# Altium project Traffic_Lignt_CU.PrjPCB
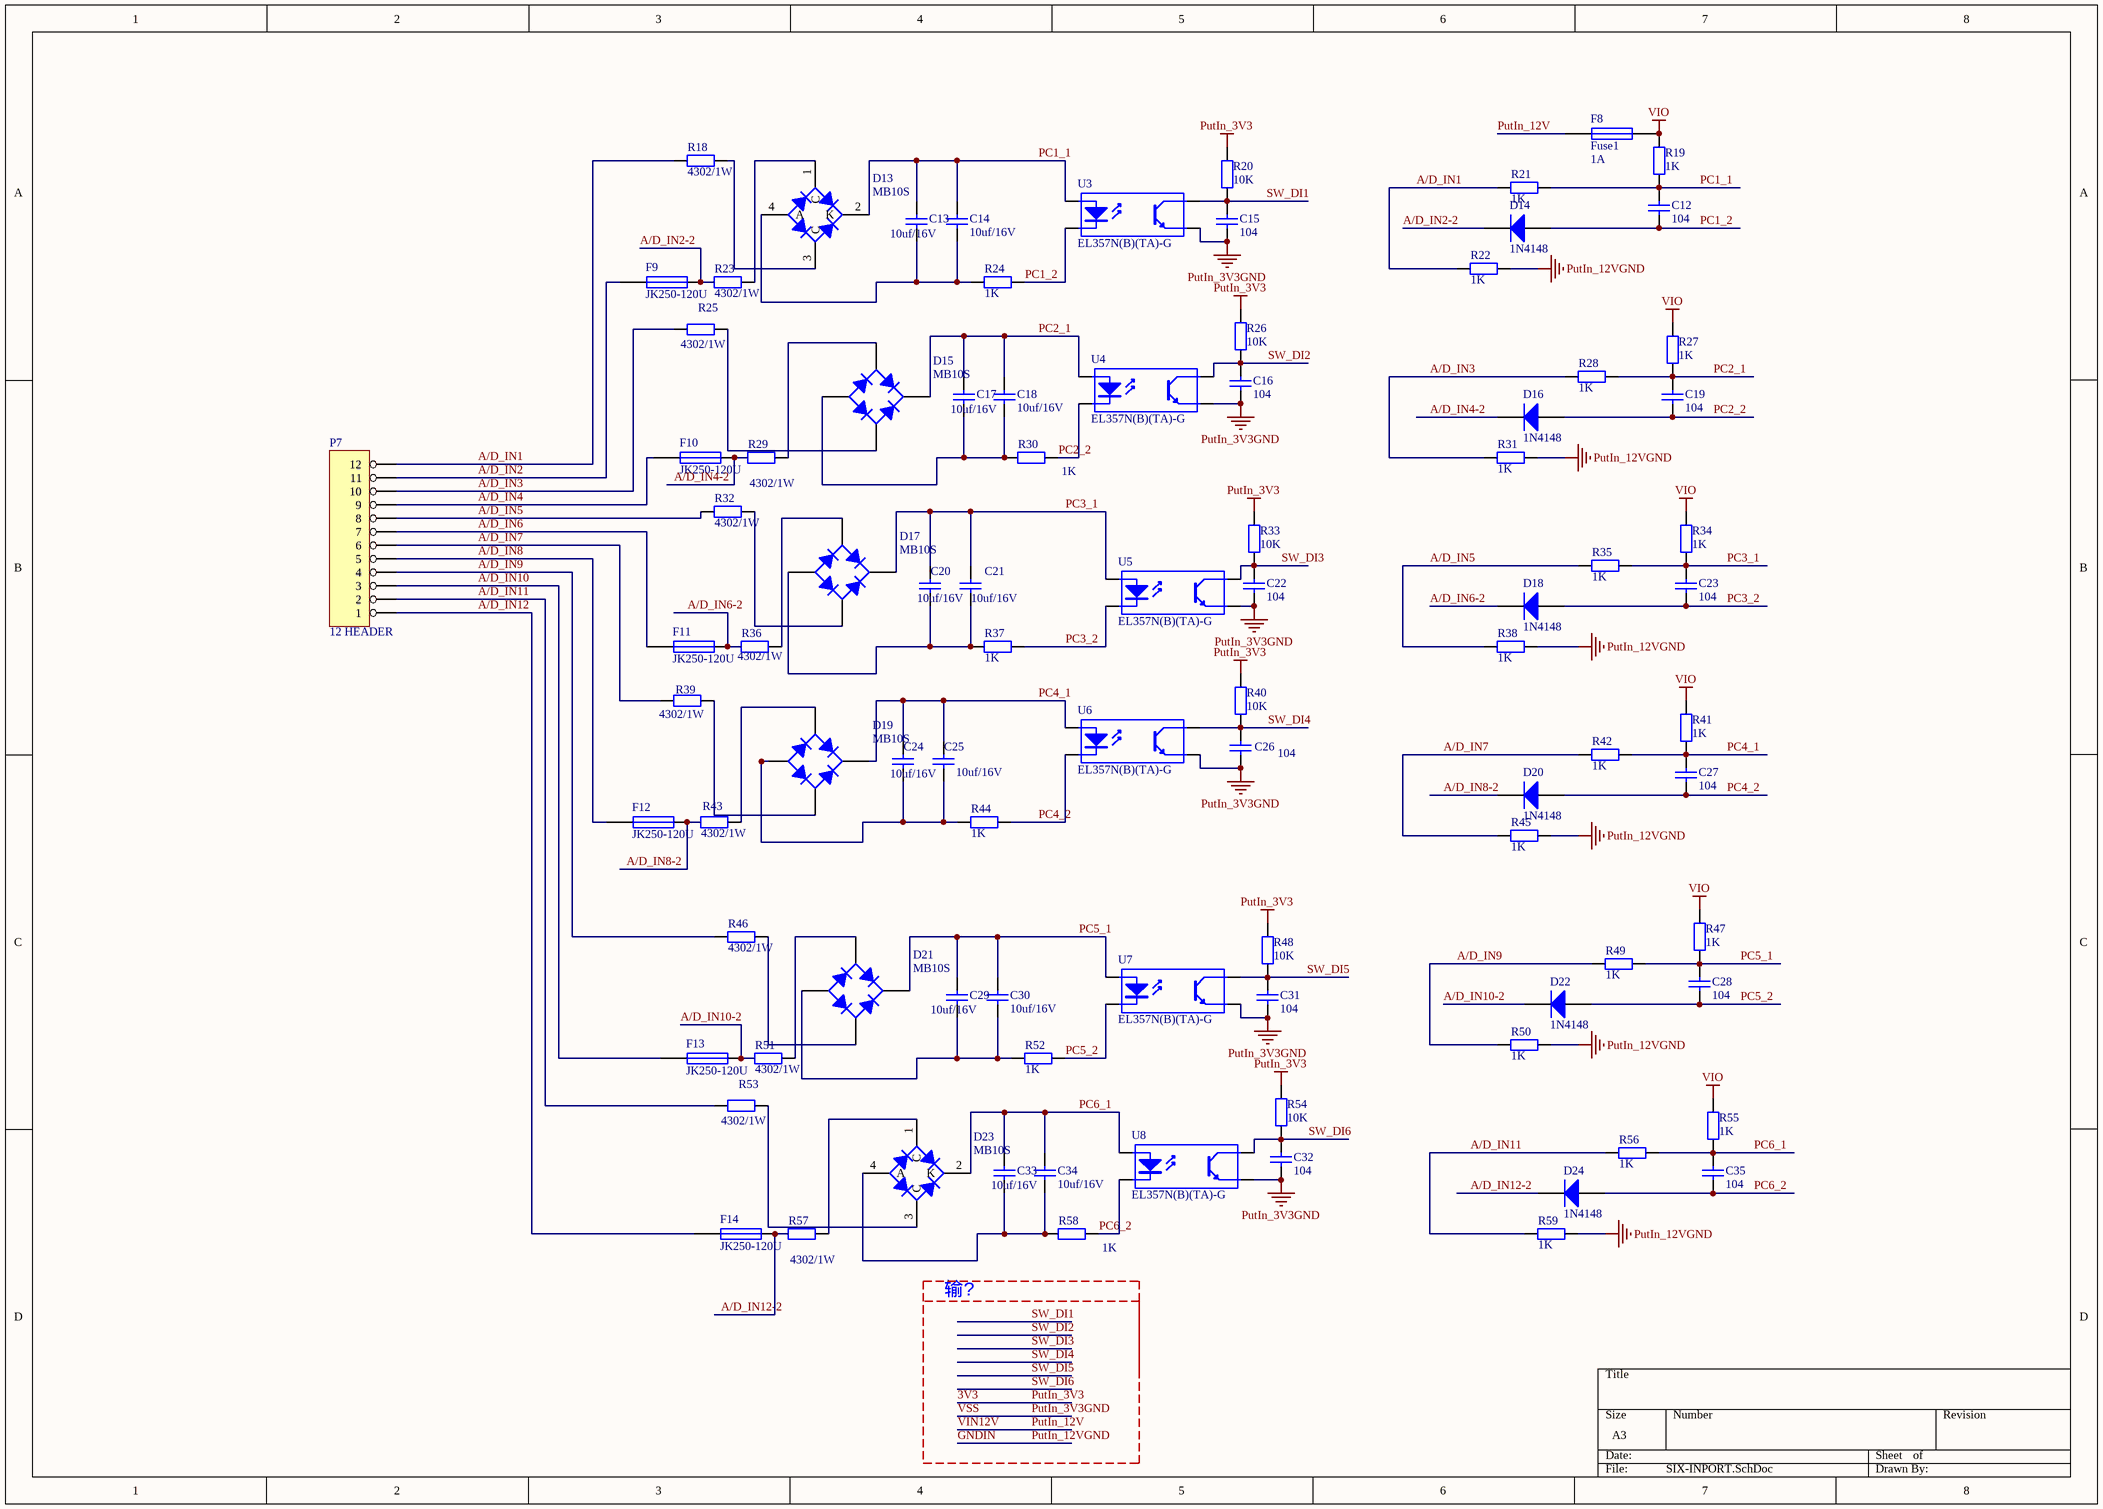
[diagram p0: SIX-INPORT.SchDoc]
5 sheets, 291 parts. Net scope: global (net labels, ports and power ports of the same name join across sheets).
Board file: Traffic_Lignt_CU.PcbDoc
Sheets:
  SIX-INPORT.SchDoc
  RS485.SchDoc
  SIX_OUTPORT-V2.SchDoc
  POWER.SchDoc
  STM32F103最小系统板.SchDoc

## Sheet SIX-INPORT.SchDoc
size A3

### Parts
(Parts that share a designator on the sheet are numbered #1, #2 ... from top to bottom, then left to right.)
C12  104  [LC-1206_C]
C13  10uf/16V  [LC-0805_C]
C14#1  10uf/16V  [LC-0805_C]
C15#1  104  [LC-0603_C]
C16  104  [LC-0603_C]
C17  10uf/16V  [LC-0805_C]
C18#1  10uf/16V  [LC-0805_C]
C19#1  104  [LC-1206_C]
C20  10uf/16V  [LC-0805_C]
C21  10uf/16V  [LC-0805_C]
C22  104  [LC-0603_C]
C23#1  104  [LC-1206_C]
C24  10uf/16V  [LC-0805_C]
C25  10uf/16V  [LC-0805_C]
C26  104  [LC-0603_C]
C27  104  [LC-1206_C]
C28  104  [LC-1206_C]
C29  10uf/16V  [LC-0805_C]
C30  10uf/16V  [LC-0805_C]
C31  104  [LC-0603_C]
C32  104  [LC-0603_C]
C33  10uf/16V  [LC-0805_C]
C34  10uf/16V  [LC-0805_C]
C35  104  [LC-1206_C]
D13  MB10S  [LC-MBS]
D14  1N4148  [LC-LL-34]
D15  MB10S  [LC-MBS]
D16#1  1N4148  [LC-LL-34]
D17  MB10S  [LC-MBS]
D18  1N4148  [LC-LL-34]
D19  MB10S  [LC-MBS]
D20  1N4148  [LC-LL-34]
D21  MB10S  [LC-MBS]
D22  1N4148  [LC-LL-34]
D23  MB10S  [LC-MBS]
D24  1N4148  [LC-LL-34]
F8  Fuse1  value 1A  [LC-1206_R]
F9  JK250-120U  [ntc250v]
F10  JK250-120U  [ntc250v]
F11  JK250-120U  [ntc250v]
F12  JK250-120U  [ntc250v]
F13  JK250-120U  [ntc250v]
F14  JK250-120U  [ntc250v]
P7  12 HEADER  [KF2EDG508-12]
R18#1  4302/1W  [LC-2512_R]
R19  value 1K  [LC-1206_R]  (hidden comment: Res1)
R20  10K  [LC-0603_R]
R21  value 1K  [LC-1206_R]  (hidden comment: Res1)
R22  value 1K  [LC-1206_R]  (hidden comment: Res1)
R23  4302/1W  [LC-2512_R]
R24  1K  [LC-0603_R]
R25  4302/1W  [LC-2512_R]
R26  10K  [LC-0603_R]
R27  value 1K  [LC-1206_R]  (hidden comment: Res1)
R28#1  value 1K  [LC-1206_R]  (hidden comment: Res1)
R29  4302/1W  [LC-2512_R]
R30  1K  [LC-0603_R]
R31  value 1K  [LC-1206_R]  (hidden comment: Res1)
R32  4302/1W  [LC-2512_R]
R33  10K  [LC-0603_R]
R34  value 1K  [LC-1206_R]  (hidden comment: Res1)
R35  value 1K  [LC-1206_R]  (hidden comment: Res1)
R36  4302/1W  [LC-2512_R]
R37  1K  [LC-0603_R]
R38  value 1K  [LC-1206_R]  (hidden comment: Res1)
R39  4302/1W  [LC-2512_R]
R40  10K  [LC-0603_R]
R41  value 1K  [LC-1206_R]  (hidden comment: Res1)
R42  value 1K  [LC-1206_R]  (hidden comment: Res1)
R43  4302/1W  [LC-2512_R]
R44  1K  [LC-0603_R]
R45  value 1K  [LC-1206_R]  (hidden comment: Res1)
R46  4302/1W  [LC-2512_R]
R47  value 1K  [LC-1206_R]  (hidden comment: Res1)
R48  10K  [LC-0603_R]
R49  value 1K  [LC-1206_R]  (hidden comment: Res1)
R50  value 1K  [LC-1206_R]  (hidden comment: Res1)
R51  4302/1W  [LC-2512_R]
R52  1K  [LC-0603_R]
R53  4302/1W  [LC-2512_R]
R54  10K  [LC-0603_R]
R55  value 1K  [LC-1206_R]  (hidden comment: Res1)
R56  value 1K  [LC-1206_R]  (hidden comment: Res1)
R57  4302/1W  [LC-2512_R]
R58  1K  [LC-0603_R]
R59  value 1K  [LC-1206_R]  (hidden comment: Res1)
U3  EL357N(B)(TA)-G  [LC-SOP-4_P2.54]
U4  EL357N(B)(TA)-G  [LC-SOP-4_P2.54]
U5  EL357N(B)(TA)-G  [LC-SOP-4_P2.54]
U6#1  EL357N(B)(TA)-G  [LC-SOP-4_P2.54]
U7  EL357N(B)(TA)-G  [LC-SOP-4_P2.54]
U8  EL357N(B)(TA)-G  [LC-SOP-4_P2.54]

### Nets
3V3: R20.2 R26.2 R33.2 R40.2 R48.2 R54.2  [also labelled PutIn_3V3]
GNDIN: R22.1 R31.1 R38.1 R45.1 R50.1 R59.1  [also labelled PutIn_12VGND]
PutIn_3V3GND: C15#1.2 C16.2 C22.2 C26.2 C31.2 C32.2 U3.3(E) U4.3(E) U5.3(E) U6#1.3(E) U7.3(E) U8.3(E)  [also labelled VSS]
PutIn_12V: F8.1  [also labelled VIN12V]
VIO: F8.2 R19.2 R27.1 R34.1 R41.1 R47.2 R55.1
A/D_IN1: P7.12 R18#1.1 R21.2 R22.2
A/D_IN2: F9.1 P7.11
A/D_IN2-2: D14.2(K) F9.2 R23.1
A/D_IN3: P7.10 R25.1 R28#1.2 R31.2
A/D_IN4: F10.1 P7.9
A/D_IN4-2: D16#1.2(K) F10.2 R29.1
A/D_IN5: P7.8 R32.1 R35.2 R38.2
A/D_IN6: F11.1 P7.7
A/D_IN6-2: D18.2(K) F11.2 R36.1
A/D_IN7: P7.6 R39.1 R42.2 R45.2
A/D_IN8: F12.1 P7.5
A/D_IN8-2: D20.2(K) F12.2 R43.1
A/D_IN9: P7.4 R46.1 R49.2 R50.2
A/D_IN10: F13.1 P7.3
A/D_IN10-2: D22.2(K) F13.2 R51.1
A/D_IN11: P7.2 R53.1 R56.2 R59.2
A/D_IN12: F14.1 P7.1
A/D_IN12-2: D24.2(K) F14.2 R57.1
PC1_1: C12.1 C13.2 C14#1.2 D13.2(K) R19.1 R21.1 U3.1(A)
PC1_2: C12.2 D14.1(A) R24.1 U3.2(K)
PC2_1: C17.2 C18#1.2 C19#1.1 D15.2(K) R27.2 R28#1.1 U4.1(A)
PC2_2: C19#1.2 D16#1.1(A) R30.1 U4.2(K)
PC3_1: C20.2 C21.2 C23#1.1 D17.2(K) R34.2 R35.1 U5.1(A)
PC3_2: C23#1.2 D18.1(A) R37.1 U5.2(K)
PC4_1: C24.2 C25.2 C27.1 D19.2(K) R41.2 R42.1 U6#1.1(A)
PC4_2: C27.2 D20.1(A) R44.1 U6#1.2(K)
PC5_1: C28.1 C29.2 C30.2 D21.2(K) R47.1 R49.1 U7.1(A)
PC5_2: C28.2 D22.1(A) R52.1 U7.2(K)
PC6_1: C33.2 C34.2 C35.1 D23.2(K) R55.2 R56.1 U8.1(A)
PC6_2: C35.2 D24.1(A) R58.1 U8.2(K)
SW_DI1: C15#1.1 R20.1 U3.4(C)
SW_DI2: C16.1 R26.1 U4.4(C)
SW_DI3: C22.1 R33.1 U5.4(C)
SW_DI4: C26.1 R40.1 U6#1.4(C)
SW_DI5: C31.1 R48.1 U7.4(C)
SW_DI6: C32.1 R54.1 U8.4(C)
NetC13_1: C13.1 C14#1.1 D13.4(A) R24.2
NetC17_1: C17.1 C18#1.1 D15.4(A) R30.2
NetC20_1: C20.1 C21.1 D17.4(A) R37.2
NetC24_1: C24.1 C25.1 D19.4(A) R44.2
NetC29_1: C29.1 C30.1 D21.4(A) R52.2
NetC33_1: C33.1 C34.1 D23.4(A) R58.2
NetD13_1: D13.1(C) R23.2
NetD13_3: D13.3(C) R18#1.2
NetD15_1: D15.1(C) R29.2
NetD15_3: D15.3(C) R25.2
NetD17_1: D17.1(C) R36.2
NetD17_3: D17.3(C) R32.2
NetD19_1: D19.1(C) R43.2
NetD19_3: D19.3(C) R39.2
NetD21_1: D21.1(C) R51.2
NetD21_3: D21.3(C) R46.2
NetD23_1: D23.1(C) R57.2
NetD23_3: D23.3(C) R53.2

### Notes on the sheet
- 输?

### Library data of the parts
C12 C19#1 C23#1 C27 C28 C35 = Cap: Capacitor; Value: 100nF; Published: 8-Jun-2000; Revision: July-2002: Re-released for DXP Platform.; Publisher: Altium Limited
C13 C14#1 C15#1 C16 C17 C18#1 C20-C22 C24-C26 C29-C34 = Cap: Capacitor; Value: 100pF; Published: 8-Jun-2000; LatestRevisionDate: 17-Jul-2002; LatestRevisionNote: Re-released for DXP Platform.; PackageReference: RAD-0.3; Publisher: Altium Limited; PackageDescription: Radial Cap, Thru-Hole; 2 Leads; 0.3 in Pin Spacing
D13 D15 D17 D19 D21 D23 = MBS M: 整流桥; ComponentLink1Description: 供应商链接; ComponentLink1URL: http://www.szlcsc.com/product/details_2865.html; Package: MBS; Supplier: LC; SuppliersPartNumber: C2488
D14 D16#1 D18 D20 D22 D24 = Diode: Default Diode; Published: 8-Jun-2000; LatestRevisionDate: 17-Jul-2002; LatestRevisionNote: Re-released for DXP Platform.; PackageDocument: Sep-1996; PackageReference: SMC; Publisher: Altium Limited; Code_JEDEC: DO-214-AB
F8 = Fus: 保险丝
F9-F14 = F: 保险丝; Value: 1A
P7 = 12 HEADER: 12 Pin Header
R18#1 R20 R23 R25 R26 R29 R32 R33 R36 R39 R40 R43 R46 R48 R51 R53 R54 R57 = Res2: Resistor; Value: 1K; Published: 8-Jun-2000; LatestRevisionDate: 17-Jul-2002; LatestRevisionNote: Re-released for DXP Platform.; PackageReference: AXIAL-0.4; Publisher: Altium Limited; PackageDescription: Axial Device, Thru-Hole; 2 Leads; 0.4 in Pin Spacing
R19 R21 R22 R27 R28#1 R31 R34 R35 R38 R41 R42 R45 R47 R49 R50 R55 R56 R59 = Res1: 贴片电阻; Published: 8-Jun-2000; LatestRevisionDate: 17-Jul-2002; LatestRevisionNote: Re-released for DXP Platform.; PackageReference: AXIAL-0.4; Publisher: Altium Limited
R24 R30 R37 R44 R52 R58 = Res2: Resistor; Published: 8-Jun-2000; LatestRevisionDate: 17-Jul-2002; LatestRevisionNote: Re-released for DXP Platform.; PackageReference: AXIAL-0.4; Publisher: Altium Limited; PackageDescription: Axial Device, Thru-Hole; 2 Leads; 0.4 in Pin Spacing; Value: 1K
U3-U5 U6#1 U7 U8 = EL357N(B): 贴片光耦; ComponentLink1Description: 供应商链接; ComponentLink1URL: http://www.szlcsc.com/product/details_7114.html; Package: SOP-4_P2.54; Supplier: LC; SuppliersPartNumber: C6649

## Sheet RS485.SchDoc
size A4
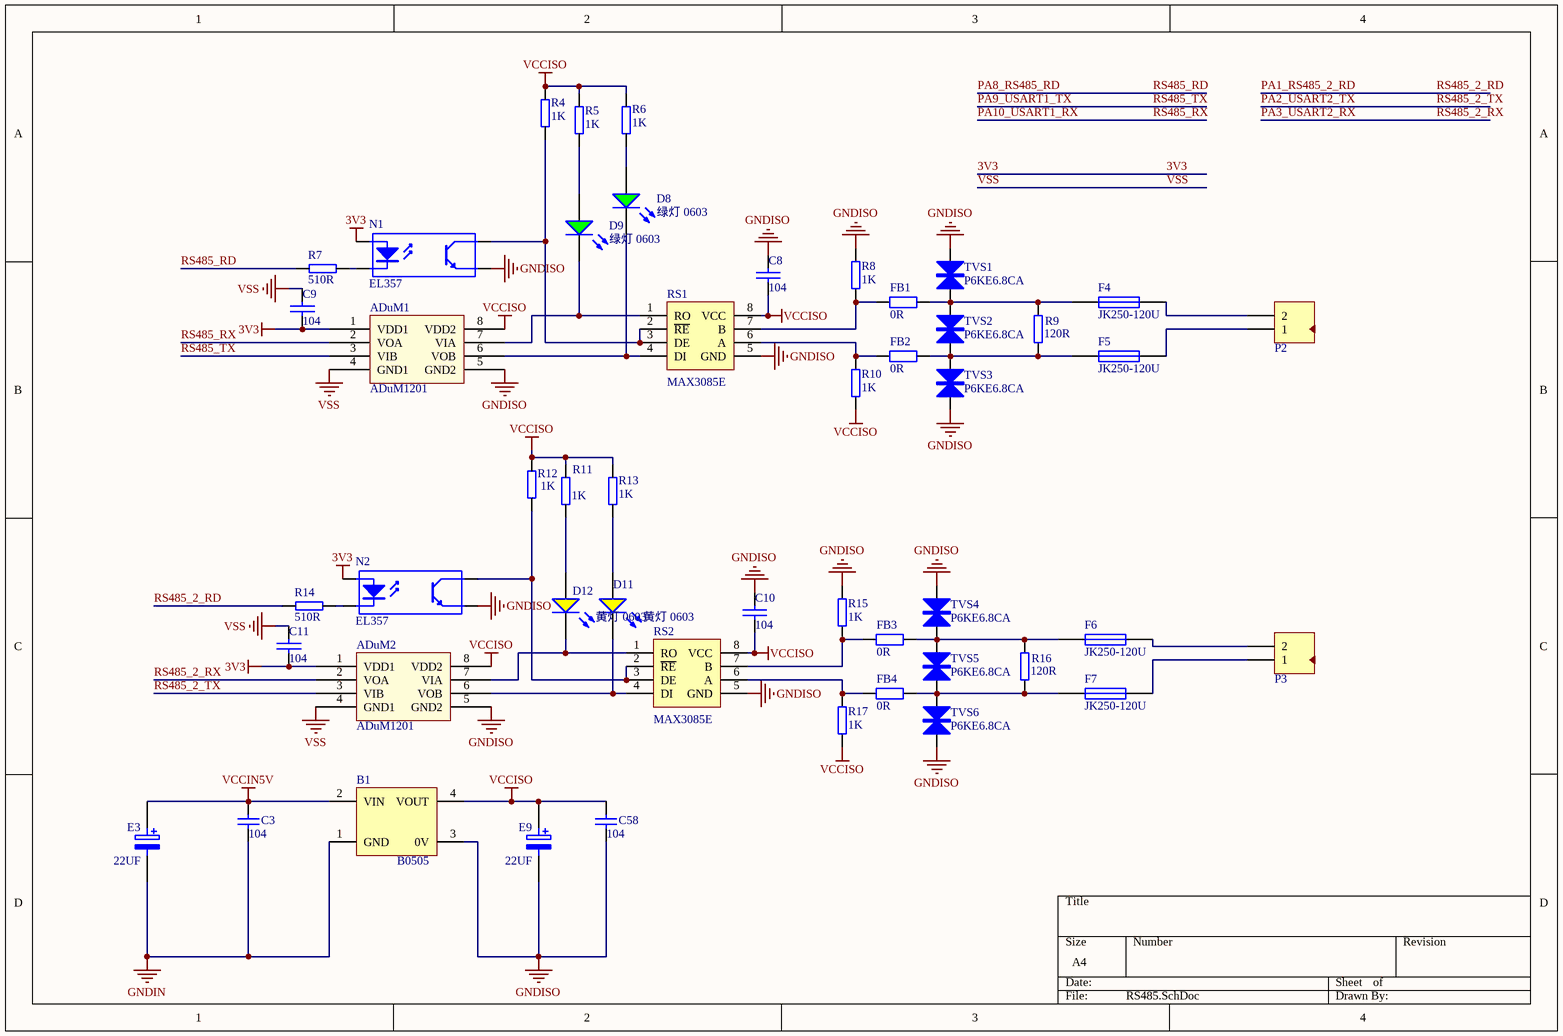
[diagram p1: RS485.SchDoc]

### Parts
(Parts that share a designator on the sheet are numbered #1, #2 ... from top to bottom, then left to right.)
ADuM1  ADuM1201  [SOIC-8]
ADuM2  ADuM1201  [SOIC-8]
B1  B0505  [B0505D-1WR2]
C3#1  104  [LC-0603_C]
C8  104  [LC-0603_C]
C9  104  [LC-0603_C]
C10  104  [LC-0603_C]
C11  104  [LC-0603_C]
C58  104  [LC-0603_C]
D8  绿灯 0603  [LC-0603_LED_S1]
D9  绿灯 0603  [LC-0603_LED_S1]
D11  黄灯 0603  [LC-0603_LED_S1]
D12  黄灯 0603  [LC-0603_LED_S1]
E3  22UF  [LC-CASE-B_3528]
E9  22UF  [LC-CASE-B_3528]
F4  JK250-120U  [ntc250v]
F5  JK250-120U  [ntc250v]
F6  JK250-120U  [ntc250v]
F7  JK250-120U  [ntc250v]
FB1  0R  [LC-0603_L]
FB2  0R  [LC-0603_L]
FB3  0R  [LC-0603_L]
FB4  0R  [LC-0603_L]
N1  EL357  [lc-sop-4_P2.54]
N2  EL357  [lc-sop-4_P2.54]
P2  Header 2  [D5.08-2P]  (value not drawn)
P3  Header 2  [D5.08-2P]  (value not drawn)
R4#1  1K  [LC-0603_R]
R5  1K  [LC-0603_R]
R6  1K  [LC-0603_R]
R7  510R  [LC-0603_R]
R8  1K  [LC-0603_R]
R9  120R  [LC-0603_R]
R10  1K  [LC-0603_R]
R11  1K  [LC-0603_R]
R12  1K  [LC-0603_R]
R13  1K  [LC-0603_R]
R14  510R  [LC-0603_R]
R15#1  1K  [LC-0603_R]
R16#1  120R  [LC-0603_R]
R17#1  1K  [LC-0603_R]
RS1  MAX3085E  [SOIC-8]
RS2  MAX3085E  [SOIC-8]
TVS1  P6KE6.8CA  [TVS]
TVS2  P6KE6.8CA  [TVS]
TVS3  P6KE6.8CA  [TVS]
TVS4  P6KE6.8CA  [TVS]
TVS5  P6KE6.8CA  [TVS]
TVS6  P6KE6.8CA  [TVS]

### Nets
3V3: ADuM1.1(VDD1) ADuM2.1(VDD1) C9.2 C11.2 N1.1(A) N2.1(A)
GNDIN: B1.1(GND) C3#1.2 E3.2
GNDISO: ADuM1.5(GND2) ADuM2.5(GND2) B1.3(0V) C8.1 C10.1 C58.2 E9.2 N1.3(E) N2.3(E) R8.1 R15#1.1 RS1.5(GND) RS2.5(GND) TVS1.2 TVS3.1 TVS4.2 TVS6.1
VCCIN5V: B1.2(VIN) C3#1.1 E3.1
VCCISO: ADuM1.8(VDD2) ADuM2.8(VDD2) B1.4(VOUT) C8.2 C10.2 C58.1 E9.1 R4#1.1 R5.2 R6.1 R10.2 R11.2 R12.1 R13.1 R17#1.2 RS1.8(VCC) RS2.8(VCC)
VSS: ADuM1.4(GND1) ADuM2.4(GND1) C9.1 C11.1  [project net PutIn_3V3GND]
PA1_RS485_2_RD: R14.1  [also labelled RS485_2_RD]
PA2_USART2_TX: ADuM2.3(VIB)  [also labelled RS485_2_TX]
PA3_USART2_RX: ADuM2.2(VOA)  [also labelled RS485_2_RX]
PA8_RS485_RD: R7.1  [also labelled RS485_RD]
PA9_USART1_TX: ADuM1.3(VIB)  [also labelled RS485_TX]
PA10_USART1_RX: ADuM1.2(VOA)  [also labelled RS485_RX]
NetADuM1_6: ADuM1.6(VOB) D8.K RS1.4(DI)
NetADuM1_7: ADuM1.7(VIA) D9.K RS1.1(RO)
NetADuM2_6: ADuM2.6(VOB) D11.K RS2.4(DI)
NetADuM2_7: ADuM2.7(VIA) D12.K RS2.1(RO)
NetD8_A: D8.A R6.2
NetD9_A: D9.A R5.1
NetD11_A: D11.A R13.2
NetD12_A: D12.A R11.1
NetF4_1: F4.1 FB1.1 R9.2 TVS1.1 TVS2.2
NetF4_2: F4.2 P2.2
NetF5_1: F5.1 FB2.1 R9.1 TVS2.1 TVS3.2
NetF5_2: F5.2 P2.1
NetF6_1: F6.1 FB3.1 R16#1.2 TVS4.1 TVS5.2
NetF6_2: F6.2 P3.2
NetF7_1: F7.1 FB4.1 R16#1.1 TVS5.1 TVS6.2
NetF7_2: F7.2 P3.1
NetFB1_2: FB1.2 R8.2 RS1.7(B)
NetFB2_2: FB2.2 R10.1 RS1.6(A)
NetFB3_2: FB3.2 R15#1.2 RS2.7(B)
NetFB4_2: FB4.2 R17#1.1 RS2.6(A)
NetN1_2: N1.2(K) R7.2
NetN1_4: N1.4(C) R4#1.2 RS1.2(~{RE}) RS1.3(DE)
NetN2_2: N2.2(K) R14.2
NetN2_4: N2.4(C) R12.2 RS2.2(~{RE}) RS2.3(DE)

### Library data of the parts
C3#1 C58 = Cap: Capacitor; Value: 100nF; Published: 8-Jun-2000; Revision: July-2002: Re-released for DXP Platform.; Publisher: Altium Limited
C8-C11 = CAP
D8 D9 D11 D12 = 0: 发光二极管; ComponentLink1Descrip: 供应商链接; Package: 0603; Supplier: LC
  D8 D9: ComponentLink1URL: http://www.szlcsc.com/product/details_73152.html; SuppliersPartNumber: C72043
  D11 D12: ComponentLink1URL: http://www.szlcsc.com/product/details_73147.html; SuppliersPartNumber: C72038
E3 E9 = ELECTRO2: Electrolytic Capacitor
F4-F7 = F: 保险丝; Value: 1A
FB1-FB4 = Res2: Resistor; Published: 8-Jun-2000; LatestRevisionDate: 17-Jul-2002; LatestRevisionNote: Re-released for DXP Platform.; PackageReference: AXIAL-0.4; Publisher: Altium Limited; Value: 0R
N1 N2 = ST188: 反射式光电传感器; Published: 24-Mar-1999; LatestRevisionDate: 04-Mar-2005; LatestRevisionNote: Sch pins 3 & 4 Swapped.; DatasheetDocument: Nov-2003; PackageReference: DIP-4; Publisher: Altium Limited
P2 P3 = He: 接插件; LatestRevisionDate: 17-Jul-2002; LatestRevisionNote: Re-released for DXP Platform.; Publisher: Altium Limited
R4#1 R5-R7 R11-R14 = RES2
R8-R10 R15#1 R16#1 R17#1 = RES
TVS1-TVS6 = TVS

## Sheet SIX_OUTPORT-V2.SchDoc
size A3
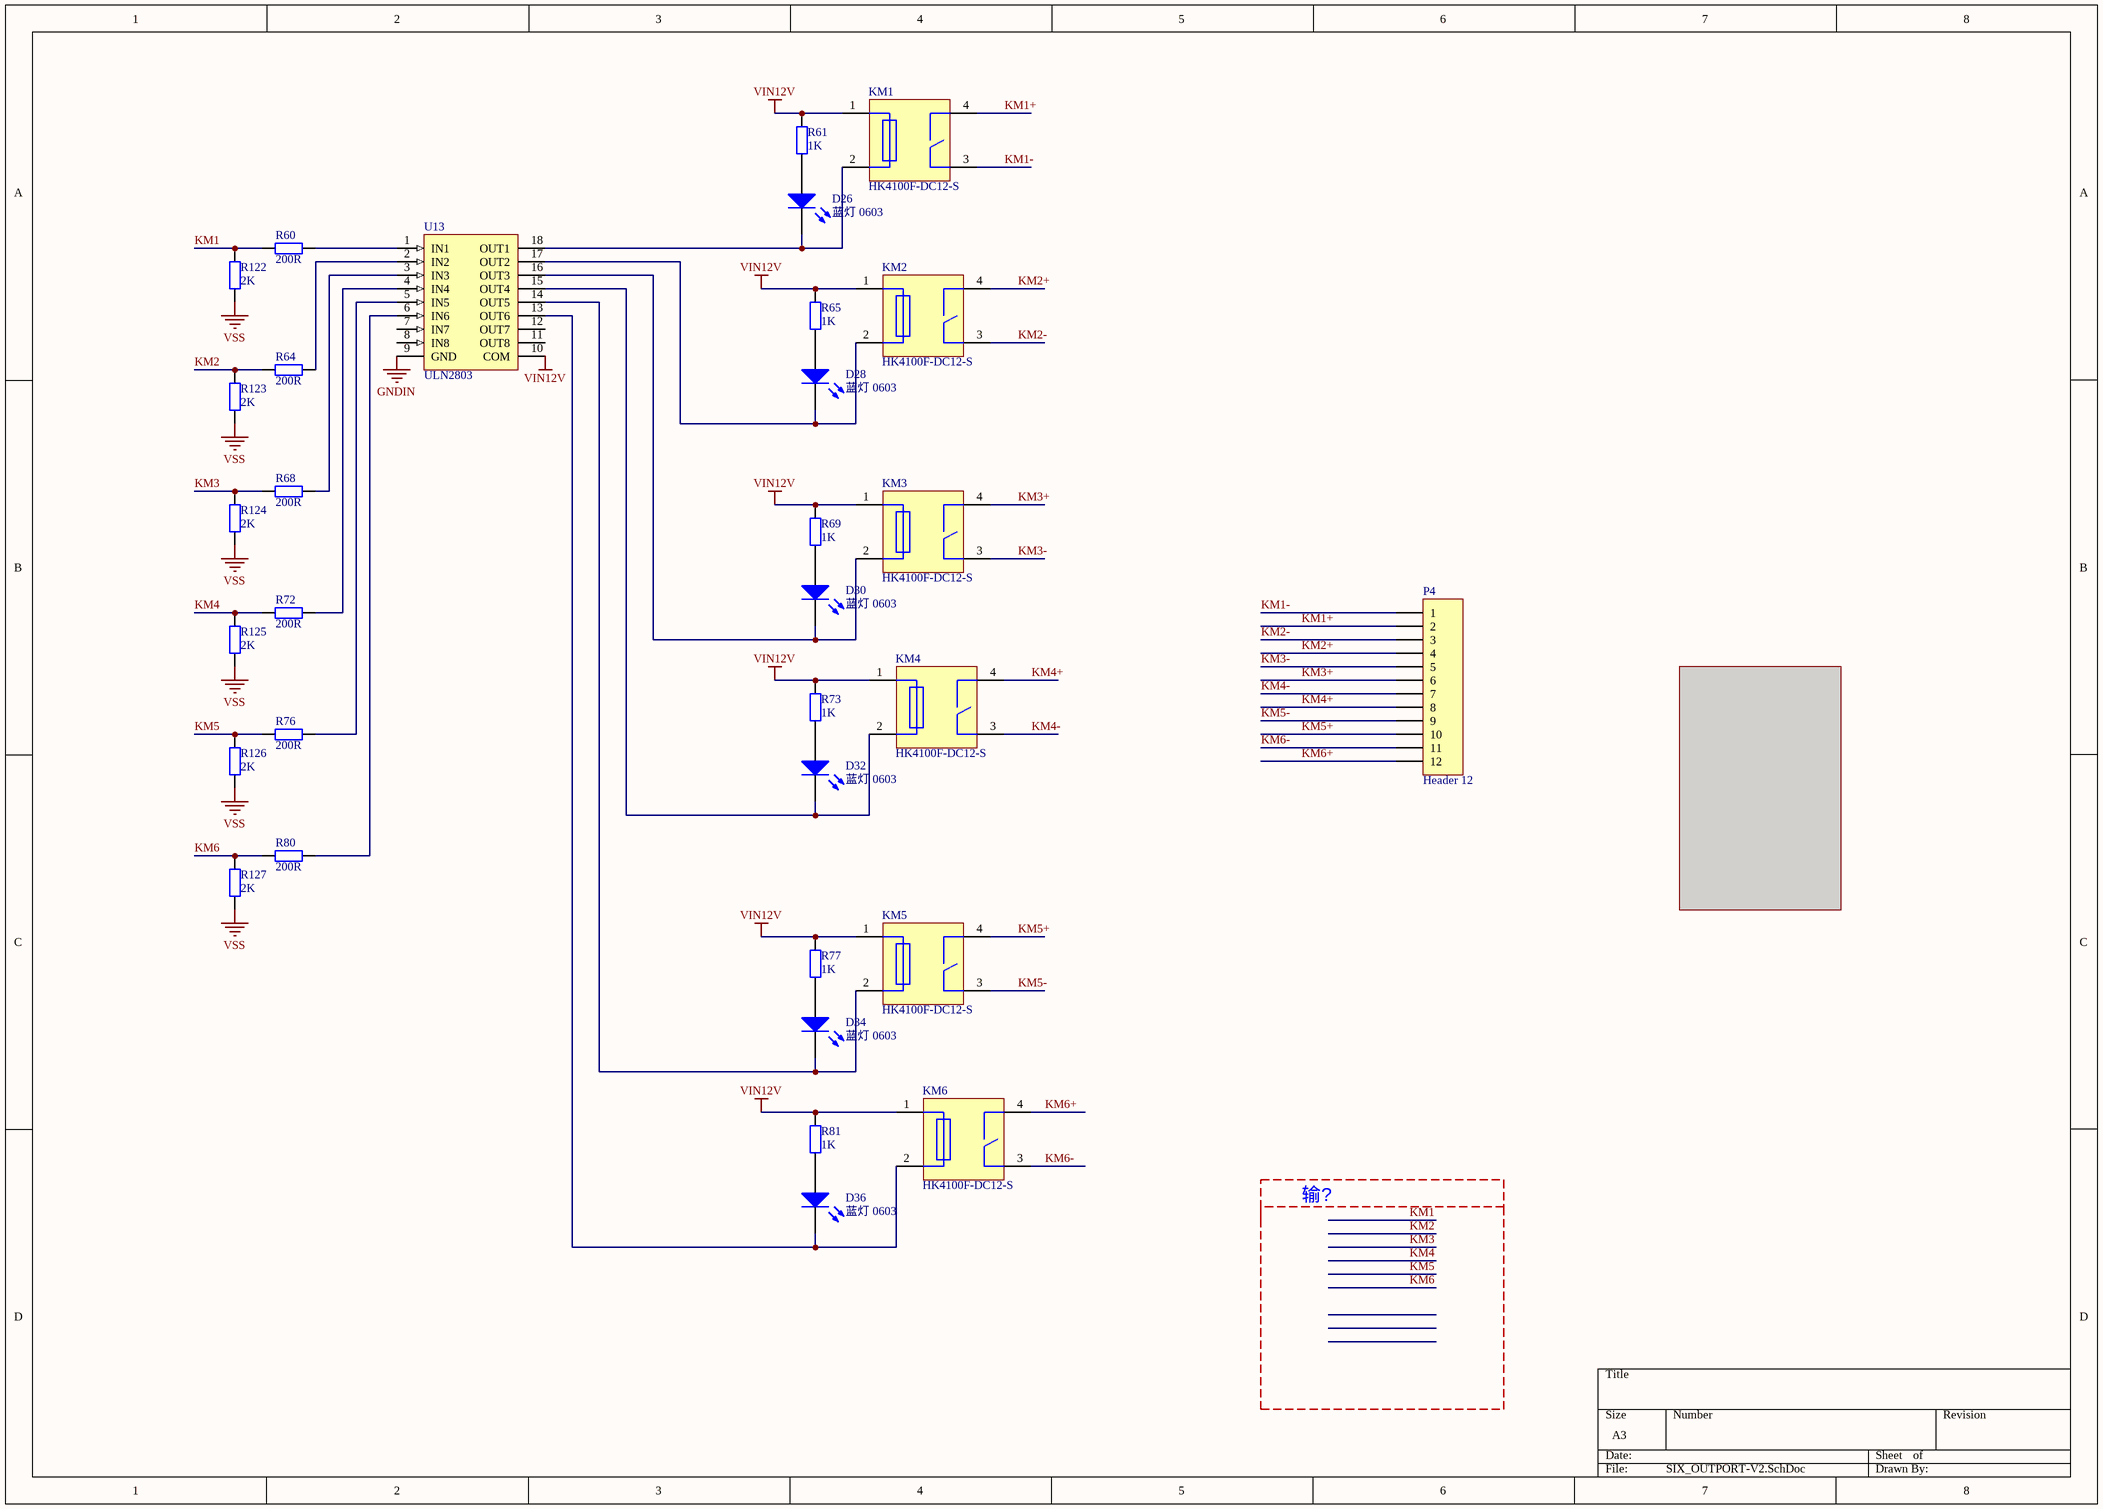
[diagram p2: SIX_OUTPORT-V2.SchDoc]

### Parts
D26  蓝灯 0603  [LC-0603_LED_S1]
D28  蓝灯 0603  [LC-0603_LED_S1]
D30  蓝灯 0603  [LC-0603_LED_S1]
D32  蓝灯 0603  [LC-0603_LED_S1]
D34  蓝灯 0603  [LC-0603_LED_S1]
D36  蓝灯 0603  [LC-0603_LED_S1]
KM1  HK4100F-DC12-S  [JCZ-32F]
KM2  HK4100F-DC12-S  [JCZ-32F]
KM3  HK4100F-DC12-S  [JCZ-32F]
KM4  HK4100F-DC12-S  [JCZ-32F]
KM5  HK4100F-DC12-S  [JCZ-32F]
KM6  HK4100F-DC12-S  [JCZ-32F]
P4  Header 12  [F5.08-12P]
R60  200R  [LC-0603_R]
R61  1K  [LC-0603_R]
R64  200R  [LC-0603_R]
R65  1K  [LC-0603_R]
R68  200R  [LC-0603_R]
R69  1K  [LC-0603_R]
R72  200R  [LC-0603_R]
R73  1K  [LC-0603_R]
R76  200R  [LC-0603_R]
R77  1K  [LC-0603_R]
R80  200R  [LC-0603_R]
R81  1K  [LC-0603_R]
R122  2K  [LC-0603_R]
R123  2K  [LC-0603_R]
R124  2K  [LC-0603_R]
R125  2K  [LC-0603_R]
R126  2K  [LC-0603_R]
R127  2K  [LC-0603_R]
U13  ULN2803  [LC-SOIC-18_300mil]

### Nets
GNDIN: U13.9(GND)
VIN12V: KM1.1 KM2.1 KM3.1 KM4.1 KM5.1 KM6.1 R61.1 R65.1 R69.1 R73.1 R77.1 R81.1 U13.10(COM)  [project net PutIn_12V]
VSS: R122.2 R123.2 R124.2 R125.2 R126.2 R127.2  [project net PutIn_3V3GND]
KM1: R60.2 R122.1
KM1+: KM1.4 P4.2
KM1-: KM1.3 P4.1
KM2: R64.2 R123.1
KM2+: KM2.4 P4.4
KM2-: KM2.3 P4.3
KM3: R68.2 R124.1
KM3+: KM3.4 P4.6
KM3-: KM3.3 P4.5
KM4: R72.2 R125.1
KM4+: KM4.4 P4.8
KM4-: KM4.3 P4.7
KM5: R76.2 R126.1
KM5+: KM5.4 P4.10
KM5-: KM5.3 P4.9
KM6: R80.2 R127.1
KM6+: KM6.4 P4.12
KM6-: KM6.3 P4.11
NetD26_A: D26.A R61.2
NetD26_K: D26.K KM1.2 U13.18(OUT1)
NetD28_A: D28.A R65.2
NetD28_K: D28.K KM2.2 U13.17(OUT2)
NetD30_A: D30.A R69.2
NetD30_K: D30.K KM3.2 U13.16(OUT3)
NetD32_A: D32.A R73.2
NetD32_K: D32.K KM4.2 U13.15(OUT4)
NetD34_A: D34.A R77.2
NetD34_K: D34.K KM5.2 U13.14(OUT5)
NetD36_A: D36.A R81.2
NetD36_K: D36.K KM6.2 U13.13(OUT6)
NetR60_1: R60.1 U13.1(IN1)
NetR64_1: R64.1 U13.2(IN2)
NetR68_1: R68.1 U13.3(IN3)
NetR72_1: R72.1 U13.4(IN4)
NetR76_1: R76.1 U13.5(IN5)
NetR80_1: R80.1 U13.6(IN6)

Not connected (* = marked no-connect by the designer): U13 7(IN7) 8(IN8) 11(OUT8) 12(OUT7)

### Notes on the sheet
- 输?

### Library data of the parts
D26 D28 D30 D32 D34 D36 = 0603 蓝灯: 发光二极管; ComponentLink1Description: 供应商链接; ComponentLink1URL: http://www.szlcsc.com/product/details_73150.html; Package: 0603; Supplier: LC; SuppliersPartNumber: C72041
KM1-KM6 = RELAY-HK4100F: 单刀双掷继电器
P4 = Header 12: Header, 12-Pin; LatestRevisionDate: 17-Jul-2002; LatestRevisionNote: Re-released for DXP Platform.; Publisher: Altium Limited
R60 R64 R68 R72 R76 R80 R122-R127 = Res2: Resistor; Value: 1K; Published: 8-Jun-2000; LatestRevisionDate: 17-Jul-2002; LatestRevisionNote: Re-released for DXP Platform.; PackageReference: AXIAL-0.4; Publisher: Altium Limited
R61 R65 R69 R73 R77 R81 = Res2: Resistor; Published: 8-Jun-2000; LatestRevisionDate: 17-Jul-2002; LatestRevisionNote: Re-released for DXP Platform.; PackageReference: AXIAL-0.4; Publisher: Altium Limited; Value: 1K

## Sheet POWER.SchDoc
size A4
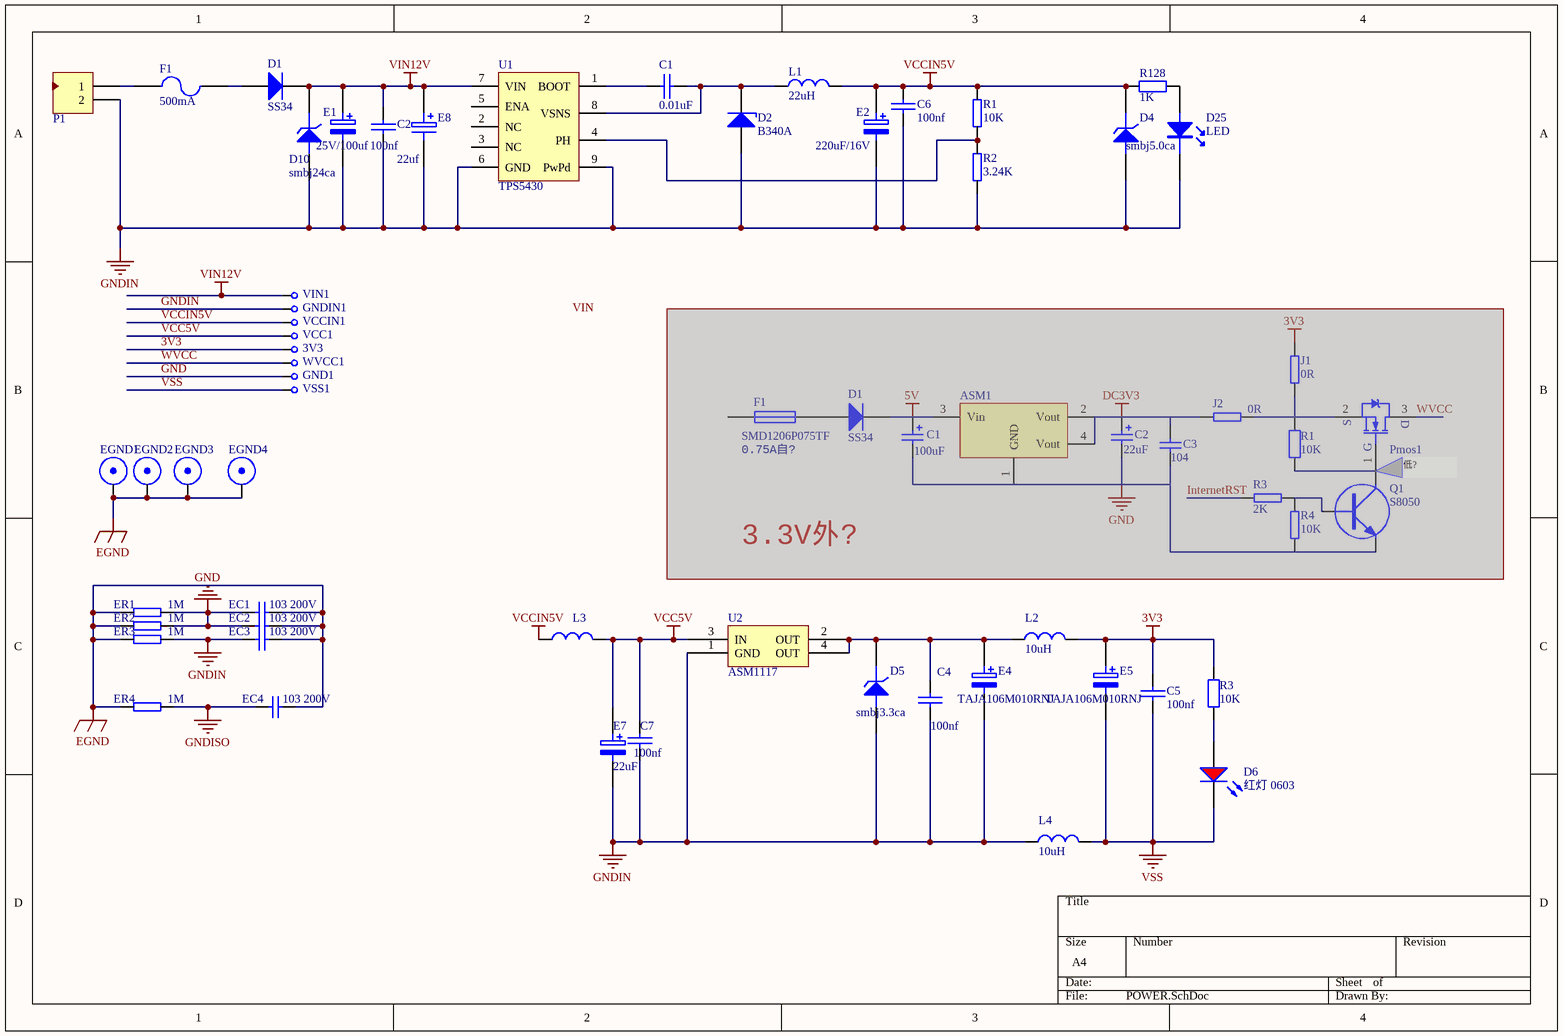
[diagram p3: POWER.SchDoc]

### Parts
(Parts that share a designator on the sheet are numbered #1, #2 ... from top to bottom, then left to right.)
3V3  CHECK  [CHECK-B]  (value not drawn)
ASM1  ASM1117-3.3  [LC-SOT-223]  (value not drawn)  (masked out: inside a compile mask, not in the netlist)
C1#1  0.01uF  [LC-0603_C]
C1#2  100uF  [HONOR_63X54]  (masked out: inside a compile mask, not in the netlist)
C2#1  100nf  [LC-0603_C]
C2#2  22uF  [HONOR_63X54]  (masked out: inside a compile mask, not in the netlist)
C3#2  104  [LC-0603_C]  (masked out: inside a compile mask, not in the netlist)
C4  100nf  [LC-0603_C]
C5  100nf  [LC-0603_C]
C6  100nf  [LC-0603_C]
C7  100nf  [LC-0603_C]
D1#1  SS34  [LC-SMA(DO-214AC)_S1]
D1#2  SS34  [LC-SMA(DO-214AC)_S5]  (masked out: inside a compile mask, not in the netlist)
D2  value B340A  [LC-SMA(DO-214AC)_S1]  (hidden comment: Diode-Z)
D4  smbj5.0ca  [LC-SMB(DO-214AA)_S1]
D5  smbj3.3ca  [LC-SMB(DO-214AA)_S1]
D6  红灯 0603  [LC-0603_LED_S1]
D10  smbj24ca  [LC-SMB(DO-214AA)_S1]
D25  LED  [LC-0603_LED_S1]
E1  25V/100uf  [C-RB-SD8]
E2  220uF/16V  [C-RB-SD6]
E4  TAJA106M010RNJ  [LC-CASE-A_3216]
E5  TAJA106M010RNJ  [LC-CASE-A_3216]
E7  22uF  [LC-CASE-B_3528]
E8  22uf  [LC-CASE-B_3528]
EC1  103 200V  [LC-1206_C]
EC2  103 200V  [LC-1206_C]
EC3  103 200V  [LC-1206_C]
EC4  103 200V  [LC-1206_C]
EGND1  EGND  [H-6-3.2m]  (value not drawn)
EGND2  EGND  [H-6-3.2m]  (value not drawn)
EGND3  EGND  [H-6-3.2m]  (value not drawn)
EGND4  EGND  [H-6-3.2m]  (value not drawn)
ER1  1M  [LC-1206_R]
ER2  1M  [LC-1206_R]
ER3  1M  [LC-1206_R]
ER4  1M  [LC-1206_R]
F1#1  value 500mA  [1812]  (hidden comment: Fuse2)
F1#2  SMD1206P075TF  [LC-1206_R]  (masked out: inside a compile mask, not in the netlist)
GND1  CHECK  [CHECK-B]  (value not drawn)
GNDIN1  CHECK  [CHECK-B]  (value not drawn)
J1  0R  [LC-0603_L]  (masked out: inside a compile mask, not in the netlist)
J2  0R  [LC-0603_L]  (masked out: inside a compile mask, not in the netlist)
L1  value 22uH  [L-SMD-7]  (hidden comment: Inductor)
L2  value 10uH  [LC-0805_L]  (hidden comment: Inductor)
L3  22uh  [L-SMD-3012]  (value not drawn)
L4  value 10uH  [LC-0805_L]  (hidden comment: Inductor)
P1  Header 2  [D5.08-2P]  (value not drawn)
Pmos1  SI2301  [LC-SOT-23(SOT-23-3)]  (value not drawn)  (masked out: inside a compile mask, not in the netlist)
Q1  S8050  [LC-SOT-23(SOT-23-3)]  (masked out: inside a compile mask, not in the netlist)
R1#1  10K  [LC-0603_R]
R1#2  10K  [LC-0603_R]  (masked out: inside a compile mask, not in the netlist)
R2  3.24K  [LC-0603_R]
R3#1  2K  [LC-0603_R]  (masked out: inside a compile mask, not in the netlist)
R3#2  10K  [LC-0603_R]
R4#2  10K  [LC-0603_R]  (masked out: inside a compile mask, not in the netlist)
R128  1K  [LC-0603_R]
U1  TPS5430  [TPS5430]
U2  ASM1117  [SOT223]
VCC1  CHECK  [CHECK-B]  (value not drawn)
VCCIN1  CHECK  [CHECK-B]  (value not drawn)
VIN1  CHECK  [CHECK-B]  (value not drawn)
VSS1  CHECK  [CHECK-B]  (value not drawn)
WVCC1  CHECK  [CHECK-B]  (value not drawn)

### Nets
3V3: 3V3.1 C5.2 E5.1 L2.2 R3#2.1
EGND: EC1.1 EC2.1 EC3.1 EC4.1 EGND1.0 EGND2.0 EGND3.0 EGND4.0 ER1.1 ER2.1 ER3.1 ER4.1
GND: EC1.2 EC2.2 ER1.2 ER2.2 GND1.1
GNDIN: C2#1.1 C4.1 C6.1 C7.1 D2.1(A) D4.1(A) D5.1(A) D10.1(A) D25.K E1.2 E2.2 E4.2 E7.2 E8.2 EC3.2 ER3.2 GNDIN1.1 L4.1 P1.2 R2.2 U1.6(GND) U1.9(PwPd) U2.1(GND)
GNDISO: EC4.2 ER4.2
VCC5V: C7.2 E7.1 L3.2 U2.3(IN) VCC1.1
VCCIN5V: C6.2 D4.2(K) E2.1 L1.2 L3.1 R1#1.2 R128.1 VCCIN1.1
VIN12V: C2#1.2 D1#1.2(K) D10.2(K) E1.1 E8.1 U1.7(VIN) VIN1.1  [project net PutIn_12V]
VSS: C5.1 D6.K E5.2 L4.2 VSS1.1  [project net PutIn_3V3GND]
WVCC: WVCC1.1
NetC1#1_1: C1#1.1 D2.2(K) L1.1 U1.8(VSNS)
NetC1#1_2: C1#1.2 U1.1(BOOT)
NetC4_2: C4.2 D5.2(K) E4.1 L2.1 U2.2(OUT) U2.4(OUT)
NetD1#1_1: D1#1.1(A) F1#1.2
NetD6_A: D6.A R3#2.2
NetD25_A: D25.A R128.2
NetF1#1_1: F1#1.1 P1.1
NetR1#1_1: R1#1.1 R2.1 U1.4(PH)

Not connected (* = marked no-connect by the designer): U1 2(NC) 3(NC) 5(ENA)

### Notes on the sheet
- (near F1#2) 0.75A自?
- 低?
- 3.3V外?
- Labels drawn without touching a wire or pin: VIN

### Library data of the parts
3V3 = CHE: 测试点
ASM1 = VOLTREG1
C1#1 C2#1 C4-C7 = CAP: Capacitor
C1#2 C2#2 = Cap Pol1: Polarized Capacitor (Radial); Published: 8-Jun-2000; Revision: July-2002: Re-released for DXP Platform.; Publisher: Altium Limited
  C1#2: Value: 100uF
  C2#2: Value: 22uF
C3#2 = Cap: Capacitor; Value: 100nF; Published: 8-Jun-2000; Revision: July-2002: Re-released for DXP Platform.; Publisher: Altium Limited
D1#1 = D: 二极管; Published: 8-Jun-2000; LatestRevisionDate: 17-Jul-2002; LatestRevisionNote: Re-released for DXP Platform.; PackageDocument: Sep-1996; PackageReference: SMC; Publisher: Altium Limited; Code_JEDEC: DO-214-AB
D1#2 = Diode: Default Diode; Published: 8-Jun-2000; LatestRevisionDate: 17-Jul-2002; LatestRevisionNote: Re-released for DXP Platform.; PackageDocument: Sep-1996; PackageReference: SMC; Publisher: Altium Limited; Code_JEDEC: DO-214-AB
D2 = Dio: 稳压二极管; Published: 8-Jun-2000; LatestRevisionDate: 17-Jul-2002; LatestRevisionNote: Re-released for DXP Platform.; PackageReference: SMB; Publisher: Altium Limited; Code_JEDEC: DO-214-AA
D4 D5 D10 = ZENER3: Zener Diode
D6 = 0603 红灯: 发光二极管; ComponentLink1Des: 供应商链接; ComponentLink1URL: http://www.szlcsc.com/product/details_2659.html; Package: 0603; Supplier: LC; SuppliersPartNumber: C2286
E1 E2 E4 E5 E7 = ELECTRO2: Electrolytic Capacitor
E8 = ELECTRO1: Electrolytic Capacitor
EC1-EC4 = Cap: Capacitor; Value: 103; Published: 8-Jun-2000; Revision: July-2002: Re-released for DXP Platform.; Publisher: Altium Limited
ER1-ER4 R1#1 R2 = RES2
F1#1 = Fuse2: 可恢复保险丝; Published: 8-Jun-2000; LatestRevisionDate: 17-Jul-2002; LatestRevisionNote: Re-released for DXP Platform.; PackageReference: PIN-W2/E2.8; Publisher: Altium Limited
F1#2 = Fuse 1: Fuse; Published: 8-Jun-2000; LatestRevisionDate: 17-Jul-2002; LatestRevisionNote: Re-released for DXP Platform.; PackageReference: PIN-W2/E2.8; Publisher: Altium Limited
GND1 GNDIN1 VCC1 VCCIN1 VIN1 VSS1 WVCC1 = C: 测试点
J1 J2 R3#1 R4#2 = RES
L1 L2 L4 = Ind: 电感; Code_IEC: 1005; Published: 8-Jun-2000; LatestRevisionDate: 17-Jul-2002; LatestRevisionNote: Re-released for DXP Platform.; PackageReference: 0402-A; Publisher: Altium Limited; Code_JEITA: 0402
L3 = Ind: 电感; Code_IEC: 1005; Value: 10uH; Published: 8-Jun-2000; LatestRevisionDate: 17-Jul-2002; LatestRevisionNote: Re-released for DXP Platform.; PackageReference: 0402-A; Publisher: Altium Limited; Code_JEITA: 0402
P1 = Header 2: 接插件; LatestRevisionDate: 17-Jul-2002; LatestRevisionNote: Re-released for DXP Platform.; Publisher: Altium Limited
Pmos1 = N-MOS
Q1 = NPN
R1#2 R128 = Res2: Resistor; Published: 8-Jun-2000; LatestRevisionDate: 17-Jul-2002; LatestRevisionNote: Re-released for DXP Platform.; PackageReference: AXIAL-0.4; Publisher: Altium Limited
  R1#2: Value: 10K
  R128: Value: 1K
R3#2 = Res2: Resistor; Value: 1K; Published: 8-Jun-2000; LatestRevisionDate: 17-Jul-2002; LatestRevisionNote: Re-released for DXP Platform.; PackageReference: AXIAL-0.4; Publisher: Altium Limited
U2 = ASM1: 3.3V稳压芯片

## Sheet STM32F103最小系统板.SchDoc
size A3
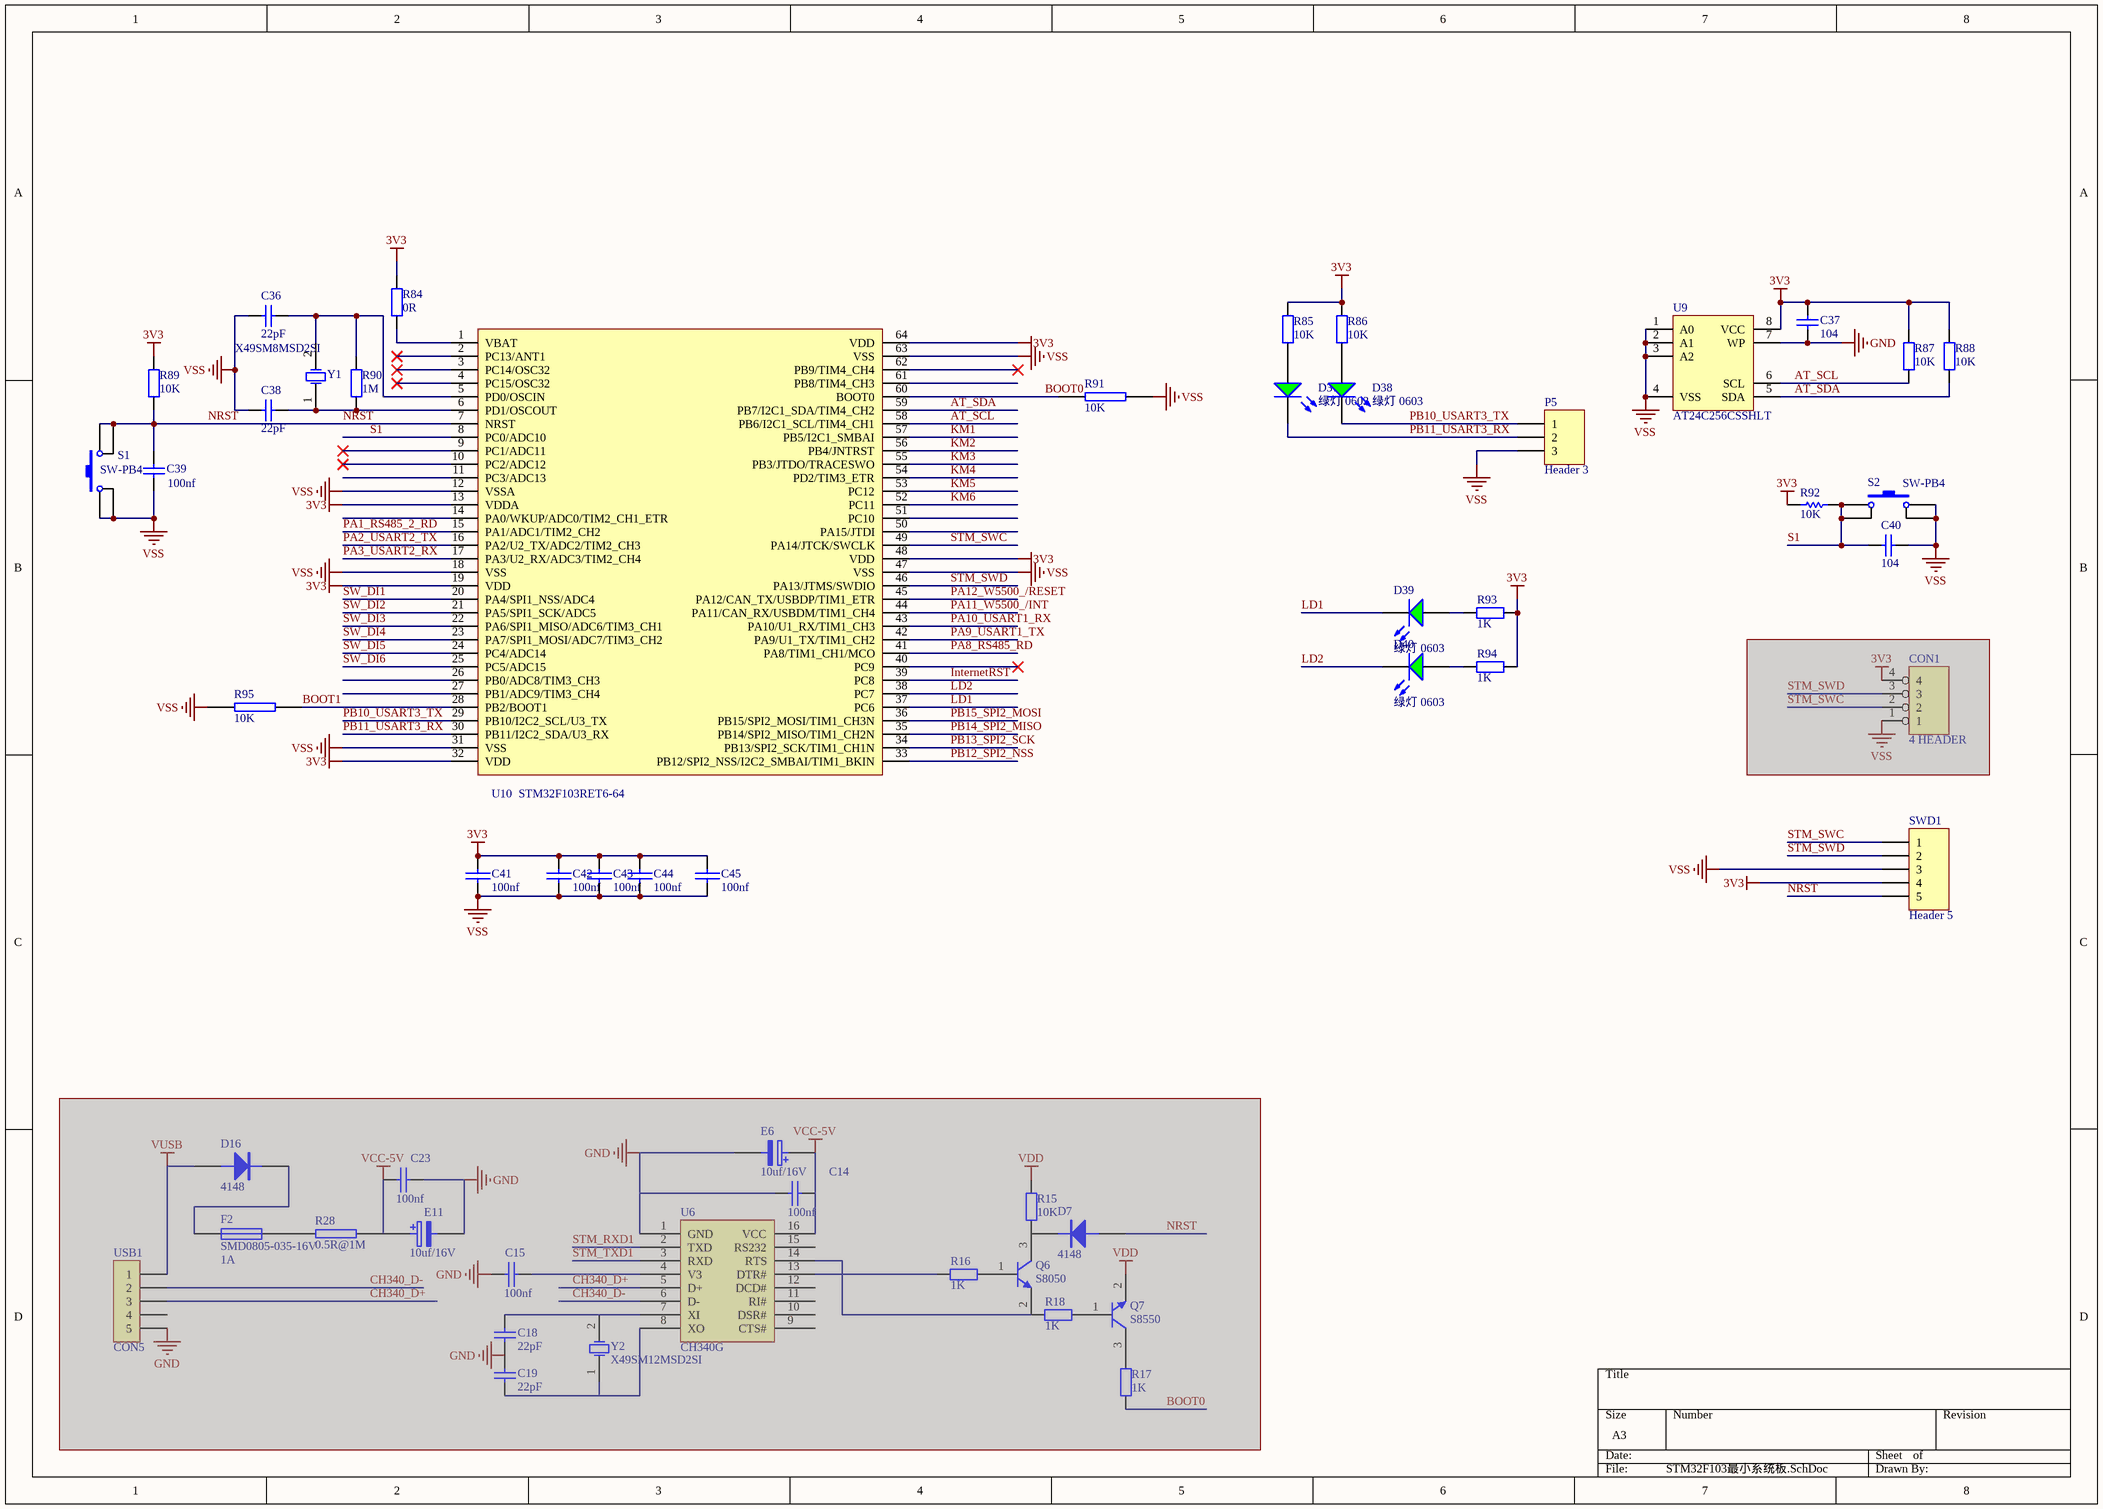
[diagram p4: STM32F103最小系统板.SchDoc]

### Parts
(Parts that share a designator on the sheet are numbered #1, #2 ... from top to bottom, then left to right.)
C14#2  100nf  [LC-0603_C]  (masked out: inside a compile mask, not in the netlist)
C15#2  100nf  [LC-0603_C]  (masked out: inside a compile mask, not in the netlist)
C18#2  22pF  [LC-0603_C]  (masked out: inside a compile mask, not in the netlist)
C19#2  22pF  [LC-0603_C]  (masked out: inside a compile mask, not in the netlist)
C23#2  100nf  [LC-0603_C]  (masked out: inside a compile mask, not in the netlist)
C36  22pF  [LC-0603_C]
C37  104  [LC-0603_C]
C38  22pF  [LC-0603_C]
C39  100nf  [LC-0603_C]
C40  104  [LC-0603_C]
C41  100nf  [LC-0603_C]
C42  100nf  [LC-0603_C]
C43  100nf  [LC-0603_C]
C44  100nf  [LC-0603_C]
C45  100nf  [LC-0603_C]
CON1  4 HEADER  [sip4]  (masked out: inside a compile mask, not in the netlist)
D7  4148  [LC-LL-34]  (masked out: inside a compile mask, not in the netlist)
D16#2  4148  [LC-LL-34]  (masked out: inside a compile mask, not in the netlist)
D37  绿灯 0603  [LC-0603_LED_S1]
D38  绿灯 0603  [LC-0603_LED_S1]
D39  绿灯 0603  [LC-0603_LED_S1]
D40  绿灯 0603  [LC-0603_LED_S1]
E6  10uf/16V  [LC-CASE-A_3216]  (masked out: inside a compile mask, not in the netlist)
E11  10uf/16V  [LC-CASE-A_3216]  (masked out: inside a compile mask, not in the netlist)
F2  SMD0805-035-16V  value 1A  [LC-0805_R]  (masked out: inside a compile mask, not in the netlist)
P5  Header 3  [HDR1X3]
Q6  S8050  [LC-SOT-23(SOT-23-3)]  (masked out: inside a compile mask, not in the netlist)
Q7  S8550  [LC-SOT-23(SOT-23-3)]  (masked out: inside a compile mask, not in the netlist)
R15#2  10K  [LC-0603_R]  (masked out: inside a compile mask, not in the netlist)
R16#2  1K  [LC-0603_R]  (masked out: inside a compile mask, not in the netlist)
R17#2  1K  [LC-0603_R]  (masked out: inside a compile mask, not in the netlist)
R18#2  1K  [LC-0603_R]  (masked out: inside a compile mask, not in the netlist)
R28#2  0.5R@1M  [LC-0805_R]  (masked out: inside a compile mask, not in the netlist)
R84  0R  [LC-0603_R]
R85  10K  [LC-0603_R]
R86  10K  [LC-0603_R]
R87  10K  [LC-0603_R]
R88  10K  [LC-0603_R]
R89  10K  [LC-0603_R]
R90  1M  [LC-0603_R]
R91  10K  [LC-0603_R]
R92  10K  [LC-0603_R]
R93  1K  [LC-0603_R]
R94  1K  [LC-0603_R]
R95  10K  [LC-0603_R]
S1  SW-PB4  [SW_PB4_A1]
S2  SW-PB4  [SW_PB4_A1]
SWD1  Header 5  [SWD-5]
U6#2  CH340G  [LC-SOIC-16_150mil]
U9  AT24C256CSSHLT  [SOIC-8]
U10  STM32F103RET6-64  [LC-LQFP-64_10x10x05P]
USB1  CON5  [USB_MICRO]  (masked out: inside a compile mask, not in the netlist)
Y1  X49SM8MSD2SI  [LC-HC-49SMD]
Y2  X49SM12MSD2SI  [LC-HC-49SMD]  (masked out: inside a compile mask, not in the netlist)

### Nets
3V3: C37.1 C41.2 C42.2 C43.2 C44.2 C45.2 R84.1 R85.1 R86.1 R87.1 R88.1 R89.2 R92.2 R93.1 R94.1 SWD1.4 U9.8(VCC) U10.13(VDDA) U10.19(VDD) U10.32(VDD) U10.48(VDD) U10.64(VDD)
GND: C37.2 U9.7(WP)
VSS: C36.1 C38.1 C39.1 C40.1 C41.1 C42.1 C43.1 C44.1 C45.1 P5.3 R91.1 R95.1 S1.1 S1.4 S2.2 S2.3 SWD1.3 U9.1(A0) U9.2(A1) U9.3(A2) U9.4(VSS) U10.12(VSSA) U10.18(VSS) U10.31(VSS) U10.47(VSS) U10.63(VSS)  [project net PutIn_3V3GND]
AT_SCL: R87.2 U9.6(SCL) U10.58(PB6/I2C1_SCL/TIM4_CH1)
AT_SDA: R88.2 U9.5(SDA) U10.59(PB7/I2C1_SDA/TIM4_CH2)
BOOT0: R91.2 U10.60(BOOT0)
BOOT1: R95.2 U10.28(PB2/BOOT1)
InternetRST: U10.39(PC8)
KM1: U10.57(PB5/I2C1_SMBAI)
KM2: U10.56(PB4/JNTRST)
KM3: U10.55(PB3/JTDO/TRACESWO)
KM4: U10.54(PD2/TIM3_ETR)
KM5: U10.53(PC12)
KM6: U10.52(PC11)
LD1: D39.K U10.37(PC6)
LD2: D40.K U10.38(PC7)
NRST: C39.2 R89.1 S1.2 S1.3 SWD1.5 U10.7(NRST)
PA1_RS485_2_RD: U10.15(PA1/ADC1/TIM2_CH2)
PA2_USART2_TX: U10.16(PA2/U2_TX/ADC2/TIM2_CH3)
PA3_USART2_RX: U10.17(PA3/U2_RX/ADC3/TIM2_CH4)
PA8_RS485_RD: U10.41(PA8/TIM1_CH1/MCO)
PA9_USART1_TX: U10.42(PA9/U1_TX/TIM1_CH2)
PA10_USART1_RX: U10.43(PA10/U1_RX/TIM1_CH3)
PA11_W5500_/INT: U10.44(PA11/CAN_RX/USBDM/TIM1_CH4)
PA12_W5500_/RESET: U10.45(PA12/CAN_TX/USBDP/TIM1_ETR)
PB10_USART3_TX: D38.K P5.1 U10.29(PB10/I2C2_SCL/U3_TX)
PB11_USART3_RX: D37.K P5.2 U10.30(PB11/I2C2_SDA/U3_RX)
PB12_SPI2_NSS: U10.33(PB12/SPI2_NSS/I2C2_SMBAI/TIM1_BKIN)
PB13_SPI2_SCK: U10.34(PB13/SPI2_SCK/TIM1_CH1N)
PB14_SPI2_MISO: U10.35(PB14/SPI2_MISO/TIM1_CH2N)
PB15_SPI2_MOSI: U10.36(PB15/SPI2_MOSI/TIM1_CH3N)
S1: C40.2 R92.1 S2.1 S2.4 U10.8(PC0/ADC10)
STM_SWC: SWD1.1 U10.49(PA14/JTCK/SWCLK)
STM_SWD: SWD1.2 U10.46(PA13/JTMS/SWDIO)
SW_DI1: U10.20(PA4/SPI1_NSS/ADC4)
SW_DI2: U10.21(PA5/SPI1_SCK/ADC5)
SW_DI3: U10.22(PA6/SPI1_MISO/ADC6/TIM3_CH1)
SW_DI4: U10.23(PA7/SPI1_MOSI/ADC7/TIM3_CH2)
SW_DI5: U10.24(PC4/ADC14)
SW_DI6: U10.25(PC5/ADC15)
NetC36_2: C36.2 R90.2 U10.5(PD0/OSCIN) Y1.2(OSC2)
NetC38_2: C38.2 R90.1 U10.6(PD1/OSCOUT) Y1.1(OSC1)
NetD37_A: D37.A R85.2
NetD38_A: D38.A R86.2
NetD39_A: D39.A R93.2
NetD40_A: D40.A R94.2
NetR84_2: R84.2 U10.1(VBAT)

Not connected (* = marked no-connect by the designer): U6#2 1(GND) 2(TXD) 3(RXD) 4(V3) 5(D+) 6(D-) 7(XI) 8(XO) 9(CTS#) 10(DSR#) 11(RI#) 12(DCD#) 13(DTR#) 14(RTS) 15(RS232) 16(VCC); U10 2(PC13/ANT1)* 3(PC14/OSC32)* 4(PC15/OSC32)* 9(PC1/ADC11)* 10(PC2/ADC12)* 11(PC3/ADC13) 14(PA0/WKUP/ADC0/TIM2_CH1_ETR) 26(PB0/ADC8/TIM3_CH3) 27(PB1/ADC9/TIM3_CH4) 40(PC9)* 50(PA15/JTDI) 51(PC10) 61(PB8/TIM4_CH3) 62(PB9/TIM4_CH4)*

### Library data of the parts
C14#2 C15#2 C23#2 C41-C45 = CAP: Capacitor
C18#2 C19#2 C36 C38 = Cap: Capacitor; Published: 8-Jun-2000; LatestRevisionDate: 17-Jul-2002; LatestRevisionNote: Re-released for DXP Platform.; PackageReference: RAD-0.3; Publisher: Altium Limited; Value: 22pF
C37 C40 = CAP: Capacitor; Value: 100nF; Published: 8-Jun-2000; Revision: July-2002: Re-released for DXP Platform.; Publisher: Altium Limited
C39 = Cap: Capacitor; Value: 0.1uF; Published: 8-Jun-2000; LatestRevisionDate: 17-Jul-2002; LatestRevisionNote: Re-released for DXP Platform.; PackageReference: RAD-0.3; Publisher: Altium Limited
CON1 = 4 HEADER: 4 Pin Header
D7 D16#2 = DIODE
D37-D40 = 0: 发光二极管; ComponentLink1Description: 供应商链接; ComponentLink1URL: http://www.szlcsc.com/product/details_73152.html; Package: 0603; Supplier: LC; SuppliersPartNumber: C72043
E6 E11 = ELECTRO2: Electrolytic Capacitor
F2 = F: 保险丝
P5 = Header 3: Header, 3-Pin; LatestRevisionDate: 17-Jul-2002; LatestRevisionNote: Re-released for DXP Platform.; Publisher: Altium Limited
Q7 = S8050
R15#2 R85-R89 = Res2: Resistor; Published: 8-Jun-2000; LatestRevisionDate: 17-Jul-2002; LatestRevisionNote: Re-released for DXP Platform.; PackageReference: AXIAL-0.4; Publisher: Altium Limited; Value: 10K
R16#2 R17#2 R18#2 R84 R90 = Res2: Resistor; Value: 10K; Published: 8-Jun-2000; LatestRevisionDate: 17-Jul-2002; LatestRevisionNote: Re-released for DXP Platform.; PackageReference: AXIAL-0.4; Publisher: Altium Limited
R28#2 R91 R95 = RES2
R92 = res1: Resistor; Published: 8-Jun-2000; Revision: July-2002: Re-released for DXP Platform.; Publisher: Altium Limited; Value: 10K
R93 R94 = R: 贴片电阻; Published: 8-Jun-2000; LatestRevisionDate: 17-Jul-2002; LatestRevisionNote: Re-released for DXP Platform.; PackageReference: AXIAL-0.4; Publisher: Altium Limited; Value: 1K
S1 = SW-: 微动开关; Published: 24-Mar-1999; LatestRevisionDate: 17-Jul-2002; LatestRevisionNote: Re-released for DXP Platform.; PackageReference: SPST-2; Publisher: Altium Limited
S2 = SW-PB4: 微动开关; Published: 24-Mar-1999; LatestRevisionDate: 17-Jul-2002; LatestRevisionNote: Re-released for DXP Platform.; PackageReference: SPST-2; Publisher: Altium Limited
SWD1 = Header 5: Header, 5-Pin; LatestRevisionDate: 17-Jul-2002; LatestRevisionNote: Re-released for DXP Platform.; Publisher: Altium Limited
U9 = AT24C02: EEROM存储器
U10 = STM32F103RBT6
USB1 = CON5: Connector
Y1 Y2 = XTAL: Crystal Oscillator; Published: 8-Jun-2000; LatestRevisionDate: 17-Jul-2002; LatestRevisionNote: Re-released for DXP Platform.; PackageReference: R38; Publisher: Altium Limited

## Nets that join several sheets
3V3: SIX-INPORT (6 pins), RS485 (6 pins), POWER (5 pins), STM32F103最小系统板 (22 pins)
GND: POWER (5 pins), STM32F103最小系统板 (C37.2 U9.7)
GNDIN: SIX-INPORT (6 pins), RS485 (B1.1 C3#1.2 E3.2), SIX_OUTPORT-V2 (U13.9), POWER (23 pins)
GNDISO: RS485 (17 pins), POWER (EC4.2 ER4.2)
PutIn_3V3GND: SIX-INPORT (12 pins), RS485 (ADuM1.4 ADuM2.4 C9.1 C11.1), SIX_OUTPORT-V2 (6 pins), POWER (5 pins), STM32F103最小系统板 (26 pins)
PutIn_12V: SIX-INPORT (F8.1), SIX_OUTPORT-V2 (13 pins), POWER (7 pins)
VCCIN5V: RS485 (B1.2 C3#1.1 E3.1), POWER (8 pins)
KM1: SIX_OUTPORT-V2 (R60.2 R122.1), STM32F103最小系统板 (U10.57)
KM2: SIX_OUTPORT-V2 (R64.2 R123.1), STM32F103最小系统板 (U10.56)
KM3: SIX_OUTPORT-V2 (R68.2 R124.1), STM32F103最小系统板 (U10.55)
KM4: SIX_OUTPORT-V2 (R72.2 R125.1), STM32F103最小系统板 (U10.54)
KM5: SIX_OUTPORT-V2 (R76.2 R126.1), STM32F103最小系统板 (U10.53)
KM6: SIX_OUTPORT-V2 (R80.2 R127.1), STM32F103最小系统板 (U10.52)
PA1_RS485_2_RD: RS485 (R14.1), STM32F103最小系统板 (U10.15)
PA2_USART2_TX: RS485 (ADuM2.3), STM32F103最小系统板 (U10.16)
PA3_USART2_RX: RS485 (ADuM2.2), STM32F103最小系统板 (U10.17)
PA8_RS485_RD: RS485 (R7.1), STM32F103最小系统板 (U10.41)
PA9_USART1_TX: RS485 (ADuM1.3), STM32F103最小系统板 (U10.42)
PA10_USART1_RX: RS485 (ADuM1.2), STM32F103最小系统板 (U10.43)
SW_DI1: SIX-INPORT (C15#1.1 R20.1 U3.4), STM32F103最小系统板 (U10.20)
SW_DI2: SIX-INPORT (C16.1 R26.1 U4.4), STM32F103最小系统板 (U10.21)
SW_DI3: SIX-INPORT (C22.1 R33.1 U5.4), STM32F103最小系统板 (U10.22)
SW_DI4: SIX-INPORT (C26.1 R40.1 U6#1.4), STM32F103最小系统板 (U10.23)
SW_DI5: SIX-INPORT (C31.1 R48.1 U7.4), STM32F103最小系统板 (U10.24)
SW_DI6: SIX-INPORT (C32.1 R54.1 U8.4), STM32F103最小系统板 (U10.25)